# EAGLE schematic esp32_samostatny_zjednodusene (EAGLE 9.0.1)
AAA: AAA
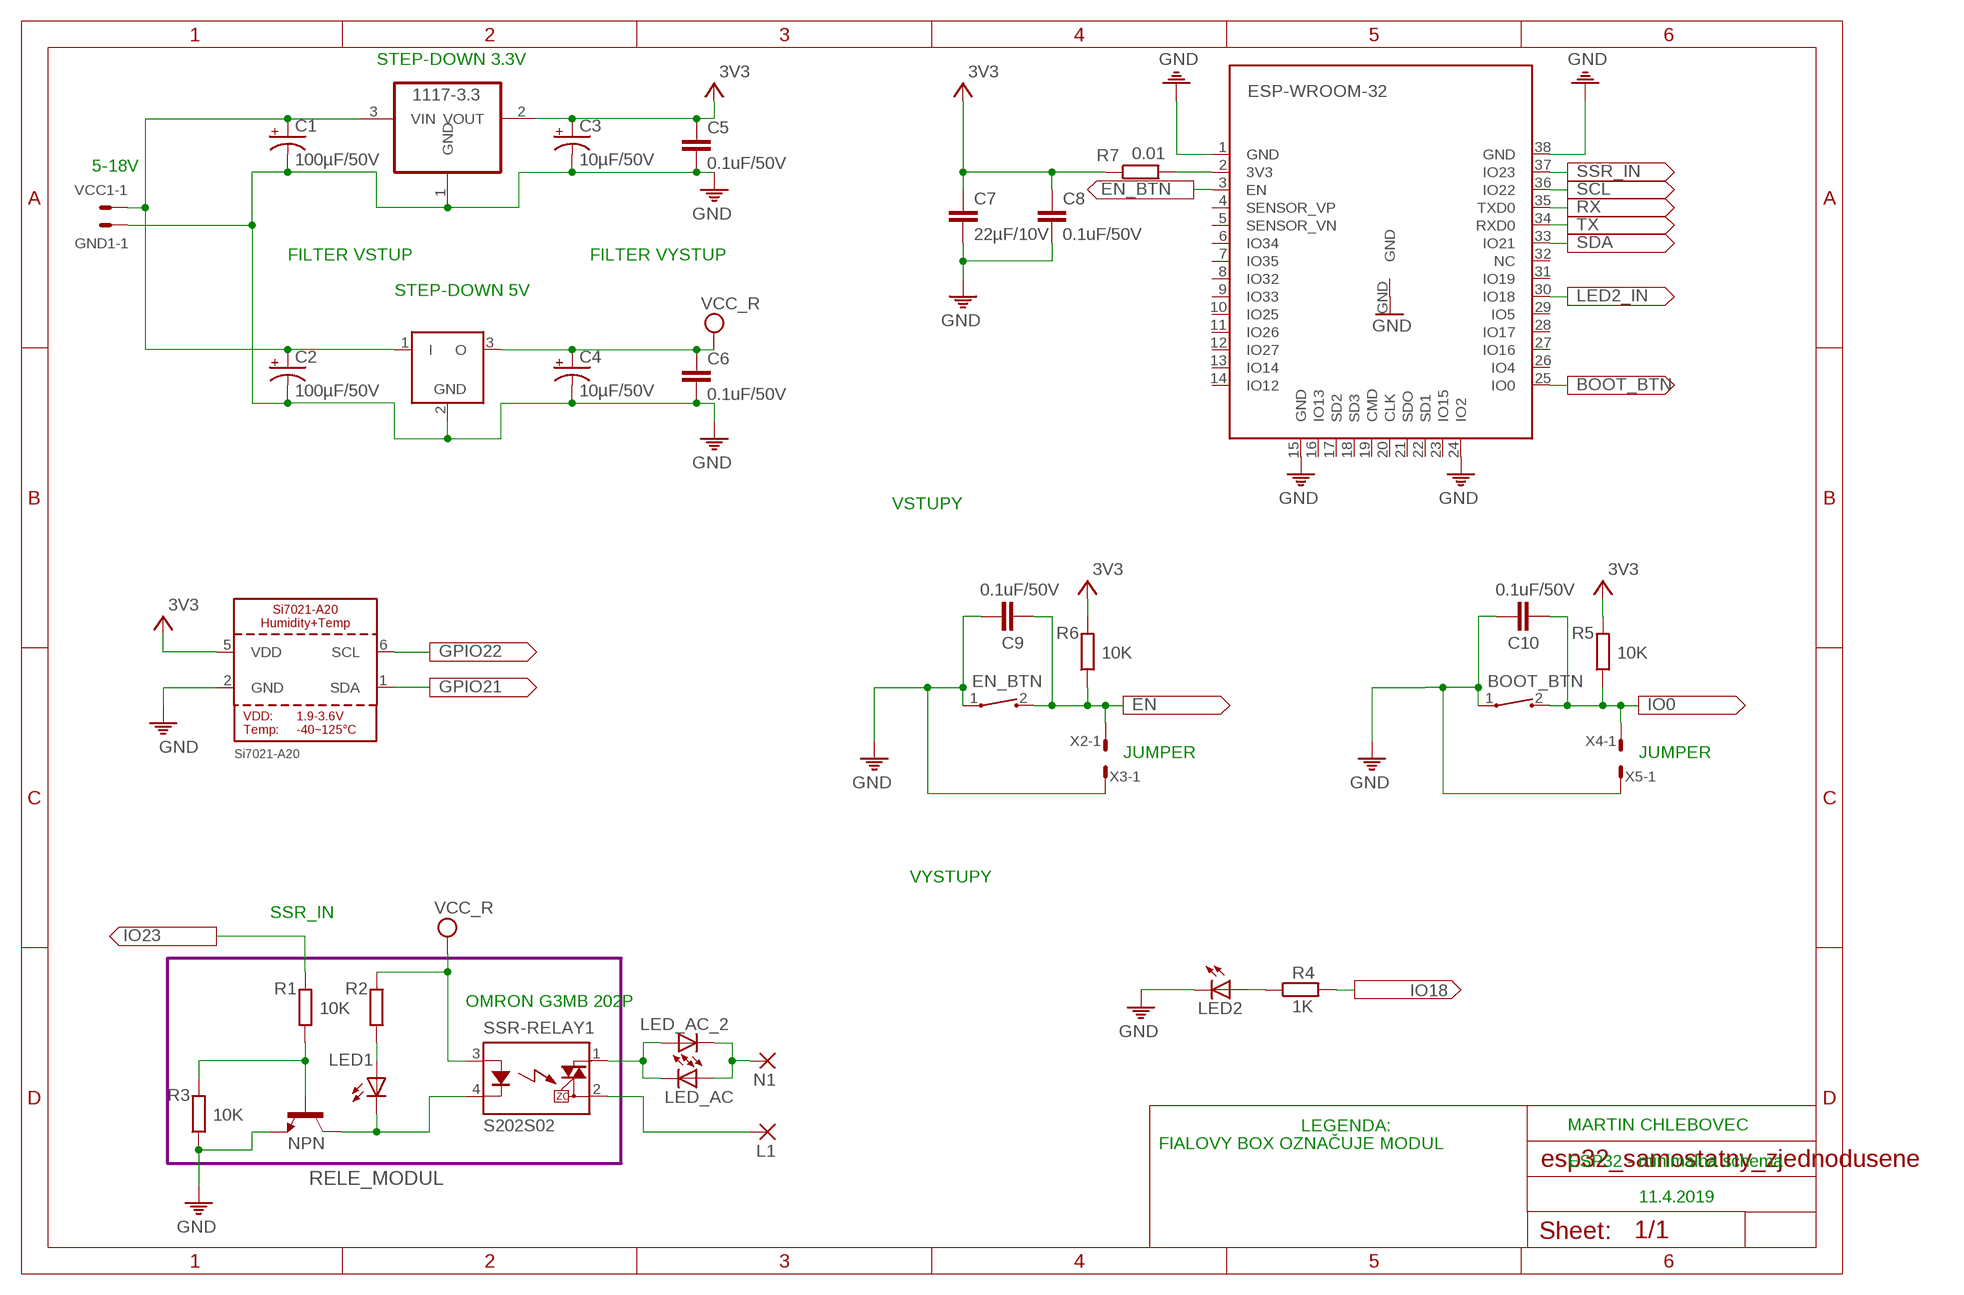
[diagram p0: schematic, sheet 1]

## Parts
1  LP2950  [DPACK]
BOOT_BTN  CT10-XXXX-G1  [CT10-XXXX-G1]
C1  100µF/50V  CPOL-US085CS-1W  [085CS_1W]
C2  100µF/50V  CPOL-US085CS-1W  [085CS_1W]
C3  10µF/50V  CPOL-US085CS-1W  [085CS_1W]
C4  10µF/50V  CPOL-US085CS-1W  [085CS_1W]
C5  0.1uF/50V  C5/3  [C5B3]
C6  0.1uF/50V  C5/3  [C5B3]
C7  22µF/10V  C5/3  [C5B3]
C8  0.1uF/50V  C5/3  [C5B3]
C9  0.1uF/50V  C5/3  [C5B3]
C10  0.1uF/50V  C5/3  [C5B3]
EN_BTN  CT10-XXXX-G1  [CT10-XXXX-G1]
GND1  332-02  [332-02]
IC1  1117-3.3  REG1117  [SOT223]
L1  1,6/0,8  [1,6/0,8]
LED1  LED5MM  [LED5MM]
LED2  LEDCHIP-LED0603  [CHIP-LED0603]
LED_AC  W49180  [Z-POWER-LED-DOME-TYPE]
LED_AC_2  W49180  [Z-POWER-LED-DOME-TYPE]
N1  1,6/0,8  [1,6/0,8]
NPN  2N1613  [TO5]
R1  10K  R  [R0805]
R2  10K  R  [R0805]
R3  10K  R  [R0805]
R4  1K  R  [R0805]
R5  10K  R  [R0805]
R6  10K  R  [R0805]
R7  0.01  R  [R0805]
SSR-RELAY1  S202S02  [S202S02]
U1  ESP-WROOM-32  [ESP-WROOM-32]
U2  Si7021-A20  SI7021-A20  [DFN6_3X3_SI]
VCC1  332-02  [332-02]
X2  332-02  [332-02]
X3  332-02  [332-02]
X4  332-02  [332-02]
X5  332-02  [332-02]

## Module instances
RELE_MODUL = A

## Nets
EN: BOOT_BTN.2 C10.2 R5.1 X4.1
EN2: C9.2 EN_BTN.2 R6.1 X2.1
GND4 [gnd]: BOOT_BTN.1 C10.1 X5.1
N$1: U1.33(IO21)
N$2: U1.34(RXD0)
N$3: U1.35(TXD0)
N$4: U1.30(IO18)
N$5: R7.2 U1.2(3V3)
N$6: U1.36(IO22)
N$7: U1.37(IO23)
N$8: R1.2
N$9: LED_AC.C LED_AC_2.A SSR-RELAY1.1(DS1)
N$10: LED_AC.A LED_AC_2.C N1.1(P)
N$11: L1.1(P) SSR-RELAY1.2(DS2)
N$13: LED2.A R4.1
N$14: LED1.K(C) NPN.3(C) SSR-RELAY1.4(K)
N$15: LED1.A
N$16: NPN.2(B) R1.1 R3.2
N$18: U2.6(SCL)
N$19: U2.1(SDA)
N$20: U1.3(EN)
N$21: U1.25(IO0)
N$23: 1.1(I) C1.+ C2.+ IC1.3(VIN) VCC1.1
N$25: R4.2
PE [gnd]: 1.2(GND) C1.- C2.- C3.- C4.- C5.2 C6.2 C8.2 C9.1 EN_BTN.1 GND1.1 IC1.1(GND) LED2.C NPN.1(E) R3.1 U1.1(GND) U1.15(GND) U1.24(IO2) U1.38(GND) U2.2(GND) X3.1 ; supply symbol labelled GND
VCC: 1.3(O) C3.+ C4.+ C5.1 C6.1 C8.1 IC1.2(VOUT) R5.2 R6.2 R7.1 SSR-RELAY1.3(A) U2.5(VDD) ; supply symbol labelled 3V3, VCC_R
Unconnected: C7.1 C7.2 GND1.2 R2.1 R2.2 U1.4(SENSOR_VP) U1.5(SENSOR_VN) U1.6(IO34) U1.7(IO35) U1.8(IO32) U1.9(IO33) U1.10(IO25) U1.11(IO26) U1.12(IO27) U1.13(IO14) U1.14(IO12) U1.16(IO13) U1.17(SD2) U1.18(SD3) U1.19(CMD) U1.20(CLK) U1.21(SDO) U1.22(SD1) U1.23(IO15) U1.26(IO4) U1.27(IO16) U1.28(IO17) U1.29(IO5) U1.31(IO19) U1.32(NC) U1.GND VCC1.2 X2.2 X3.2 X4.2 X5.2

## Notes on the sheet
- STEP-DOWN 3.3V
- 5-18V
- FILTER VSTUP | FILTER VYSTUP
- STEP-DOWN 5V
- VSTUPY
- JUMPER | JUMPER
- VYSTUPY
- SSR_IN
- OMRON G3MB 202P
- LEGENDA:
- FIALOVY BOX OZNAČUJE MODUL | MARTIN CHLEBOVEC
- ESP32 - minimalna schema
- 11.4.2019

## Library data of the parts
1 = linear:LP2950: 100 mA, Low Power Low Dropout Voltage Regulator Source: http://www.onsemi.com/pub/Collateral/LP2950-D.PDF
BOOT_BTN EN_BTN = switch-coto:CT10-XXXX-: CT10 Series Molded Switch Source: www.cotorelay.com .. Coto_Technology__CT10-1530-G1.pdf
C1-C4 = adafruit:CPOL-US: POLARIZED CAPACITOR, American symbol
C5-C10 = capacitor-wima:C: CAPACITOR naming: grid - package width
GND1 X3 = con-garry:332-02: 2 Pin - 2mm Dual Row Source: www.mpe-connector.de / garry_shortform_2012.pdf; SPICEPREFIX: X
IC1 = burr-brown:REG1117: 800mA and 1A Low Dropout (LDO) Positive Regulator 1.8V, 2.5V, 2.85V, 3.3V, 5V, and Adj; MPN: REG1117; OC_FARNELL: 1097566; OC_NEWARK: 14P6981
L1 N1 = wirepad:1,6/0,8: THROUGH-HOLE PAD
LED1 LED2 = adafruit:LED: LED OSRAM: - CHIPLED LG R971, LG N971, LY N971, LG Q971, LY Q971, LO R971, LY R971 LH N974, LH R974 LS Q976, LO Q976, LY Q976 LO Q996 - Hyper CHIPLED LW Q18S LB Q993, LB Q99A, LB R99A - SideLED LS A670, LO A670, LY A670, LG A670, LP A670 LB A673, LV A673, LT A673, LW A673 LH A674 LY A675 LS A676, LA A676, LO A676, LY A676, LW A676 LS A679, LY A679, LG A679 - Hyper Micro SIDELED® LS Y876, LA Y876, LO Y876, LY Y876 LT Y87S - SmartLED LW L88C, LW L88S LB L89C, LB L89S, LG L890 LS L89K, LO L89K, LY L89K LS L896, LA L896, LO L896, LY L896 - TOPLED LS T670, LO T670, LY T670, LG T670, LP T670 LSG T670, LSP T670, LSY T670, LOP T670, LYG T670 LG T671, LOG T671, LSG T671 LB T673, LV T673, LT T673, LW T673 LH T674 LS T676, LA T676, LO T676, LY T676, LB T676, LH T676, LSB T676, LW T676 LB T67C, LV T67C, LT T67C, LS T67K, LO T67K, LY T67K, LW E67C LS E67B, LA E67B, LO E67B, LY E67B, LB E67C, LV E67C, LT E67C LW T67C LS T679, LY T679, LG T679 LS T770, LO T770, LY T770, LG T770, LP T770 LB T773, LV T773, LT T773, LW T773 LH T774 LS E675, LA E675, LY E675, LS T675 LS T776, LA T776, LO T776, LY T776, LB T776 LHGB T686 LT T68C, LB T68C - Hyper Mini TOPLED® LB M676 - Mini TOPLED Santana® LG M470 LS M47K, LO M47K, LY M47K Source: http://www.osram.convergy.de/
LED_AC LED_AC_2 = led:W49180: Z-Power LED P4 Series, Dome type Source: http://www.acriche.com .. W49180.pdf; SPICEPREFIX: L
NPN = transistor:2N1613: NPN TRANSISTOR; SPICEPREFIX: J
R1-R7 = eagle-ltspice:R: RESISTOR, European symbol; SPICEMODEL: NONE; SPICEPREFIX: R
SSR-RELAY1 = relay:S*02S02: IT(rms) 8A, Zero Cross type SIP 4pin Triac output SSR Source: http://sharp-world.com/products/device/lineup/data/pdf/datasheet/s102s02_e.pdf; MPN: S202S02F; OC_FARNELL: 1618475; OC_NEWARK: 14N9588
U1 = esp32:ESP-WROOM-32
U2 = microbuilder:SI7021-A20: Si7021-A20 - I2C Humidity and Temperature Sensor VDD: 1.9-3.6V Operating Temperature: -40~125°C +/-3% RH (max) 0..80% RH Humidity Sensor +/-0.4°C (max-, -10~85°C Temperature Sensor 150uA Active, 60nA Standby
VCC1 X2 X4 X5 = con-garry:332-02: 2 Pin - 2mm Dual Row Source: www.mpe-connector.de / garry_shortform_2012.pdf

## Module A
Ports: 

### Library data of the parts

## Net classes
1 gnd: width 0.635 mm, drill 0.635 mm, clearance 0.254 mm
2 vcc: width 0.406 mm, drill 0.406 mm, clearance 0.254 mm